# Altium schematic sheet FTDI.SchDoc: TE0888 - FTDI
size A4; Organization: Trenz Electronic GmbH; DocumentNumber: TE0888; Revision: 01; SheetNumber: 4; SheetTotal: 5; Date: 20.05.2015; CompanyName: Trenz Electronic GmbH; ProjectName: TE0888
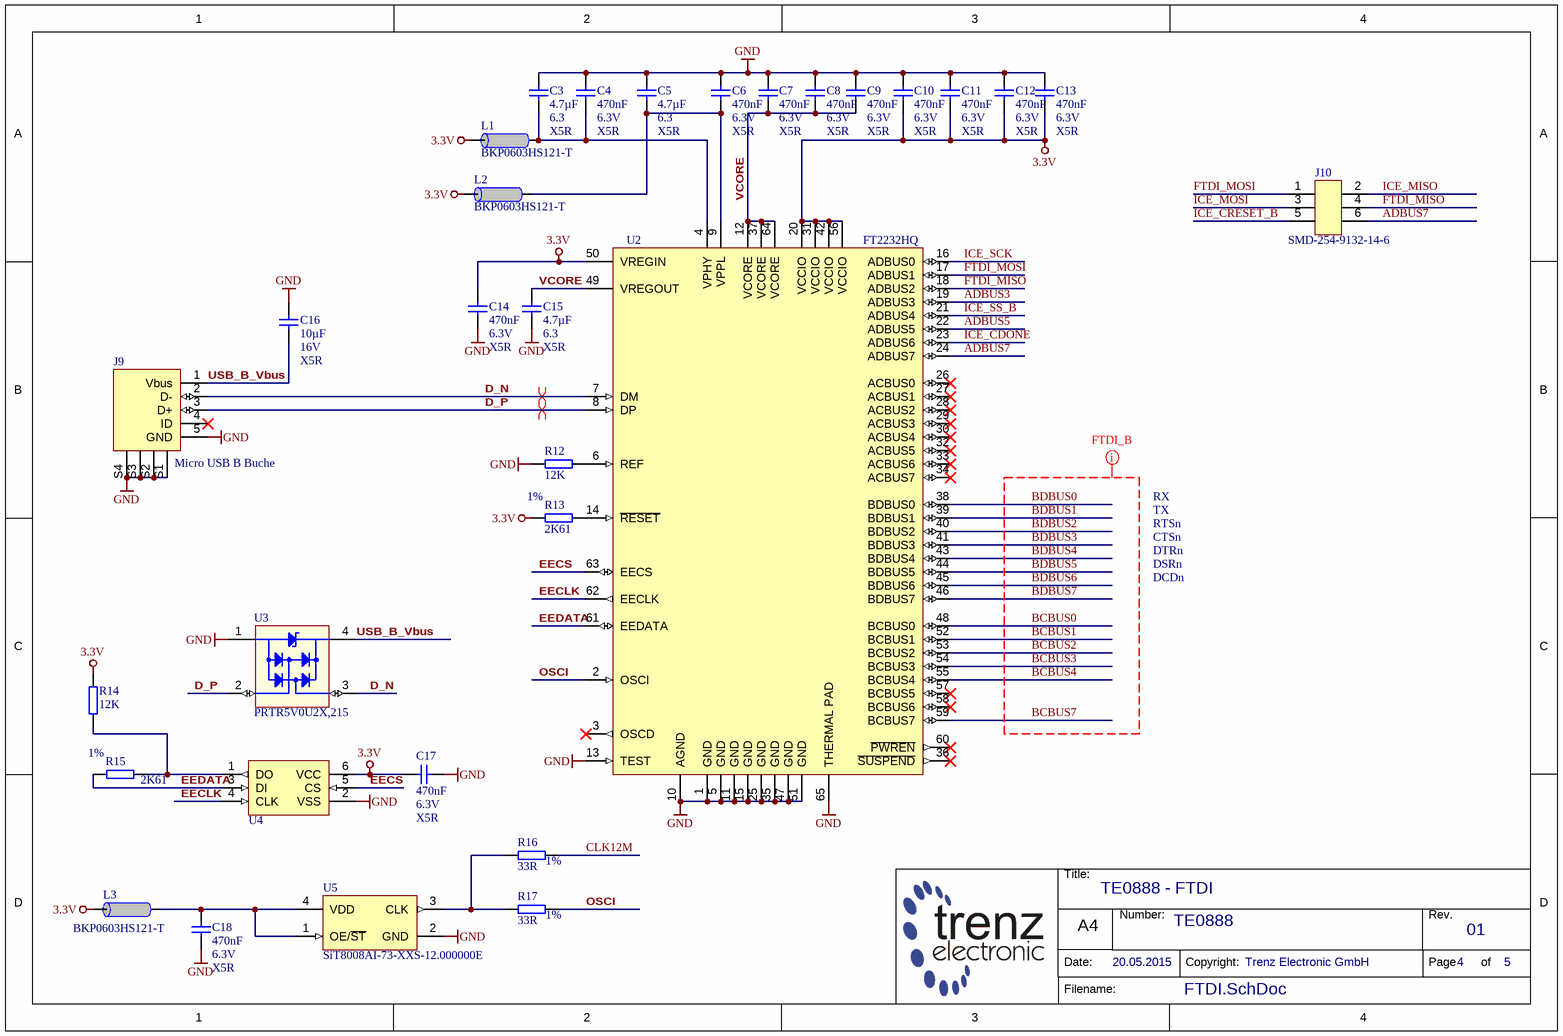
[diagram p0: FTDI.SchDoc]

## Parts
C3  4.7µF  Voltage: 6.3  Technology: X5R  [CAPC1005X60N]
C4  470nF  Voltage: 6.3V  Technology: X5R  [CAPC0603X33N]
C5  4.7µF  Voltage: 6.3  Technology: X5R  [CAPC1005X60N]
C6  470nF  Voltage: 6.3V  Technology: X5R  [CAPC0603X33N]
C7  470nF  Voltage: 6.3V  Technology: X5R  [CAPC0603X33N]
C8  470nF  Voltage: 6.3V  Technology: X5R  [CAPC0603X33N]
C9  470nF  Voltage: 6.3V  Technology: X5R  [CAPC0603X33N]
C10  470nF  Voltage: 6.3V  Technology: X5R  [CAPC0603X33N]
C11  470nF  Voltage: 6.3V  Technology: X5R  [CAPC0603X33N]
C12  470nF  Voltage: 6.3V  Technology: X5R  [CAPC0603X33N]
C13  470nF  Voltage: 6.3V  Technology: X5R  [CAPC0603X33N]
C14  470nF  Voltage: 6.3V  Technology: X5R  [CAPC0603X33N]
C15  4.7µF  Voltage: 6.3  Technology: X5R  [CAPC1005X60N]
C16  10µF  Voltage: 16V  Technology: X5R  [CAPC1608X90N]
C17  470nF  Voltage: 6.3V  Technology: X5R  [CAPC0603X33N]
C18  470nF  Voltage: 6.3V  Technology: X5R  [CAPC0603X33N]
J9  Micro USB B Buche  [Micro USB B SMD W+P]
J10  SMD-254-9132-14-6  [SMD-254-9132-14-6]
L1  BKP0603HS121-T  [INDC0603X33N]
L2  BKP0603HS121-T  [INDC0603X33N]
L3  BKP0603HS121-T  [INDC0603X33N]
R12  12K  [RESC1005X40N]
R13  2K61  Tolerance: 1%  [RESC1005X40N]
R14  12K  [RESC1005X40N]
R15  2K61  Tolerance: 1%  [RESC1005X40N]
R16  33R  Tolerance: 1%  [RESC0603X26N]
R17  33R  Tolerance: 1%  [RESC0603X26N]
U2  FT2232HQ  [QFN50P900X900X100-65N-445]
U3  PRTR5V0U2X,215  [SOT190P229X114-4N]
U4  93AA56BT-I/OT  [SOT95P280X145-6N]  (value not drawn)
U5  SiT8008AI-73-XXS-12.000000E  [2016]

## Nets
3.3V: C10.1 C11.1 C12.1 C13.1 C14.2 C17.1 L1.2 L2.2 L3.2 R13.1 R14.2 U2.20(VCCIO) U2.31(VCCIO) U2.42(VCCIO) U2.50(VREGIN) U2.56(VCCIO) U4.6(VCC)
GND: C3.2 C4.2 C5.2 C6.2 C7.2 C8.2 C9.2 C10.2 C11.2 C12.2 C13.2 C14.1 C15.1 C16.1 C17.2 C18.1 J9.5(GND) J9.S1 J9.S2 J9.S3 J9.S4 R12.1 U2.1(GND) U2.5(GND) U2.10(AGND) U2.11(GND) U2.13(TEST) U2.15(GND) U2.25(GND) U2.35(GND) U2.47(GND) U2.51(GND) U2.65(THERMAL_PAD) U3.1(GND) U4.2(VSS) U5.2(GND)
ADBUS3: U2.19(ADBUS3)
ADBUS5: U2.22(ADBUS5)
ADBUS7: J10.6 U2.24(ADBUS7)
BCBUS0: U2.48(BCBUS0)
BCBUS1: U2.52(BCBUS1)
BCBUS2: U2.53(BCBUS2)
BCBUS3: U2.54(BCBUS3)
BCBUS4: U2.55(BCBUS4)
BCBUS7: U2.59(BCBUS7)
BDBUS0: U2.38(BDBUS0)
BDBUS1: U2.39(BDBUS1)
BDBUS2: U2.40(BDBUS2)
BDBUS3: U2.41(BDBUS3)
BDBUS4: U2.43(BDBUS4)
BDBUS5: U2.44(BDBUS5)
BDBUS6: U2.45(BDBUS6)
BDBUS7: U2.46(BDBUS7)
CLK12M: R16.2
D_N: J9.2(D-) U2.7(DM) U3.3(I/O)
D_P: J9.3(D+) U2.8(DP) U3.2(I/O)
EECLK: U2.62(EECLK) U4.4(CLK)
EECS: U2.63(EECS) U4.5(CS)
EEDATA: R15.1 U2.61(EEDATA) U4.3(DI)
FTDI_MISO: J10.4 U2.18(ADBUS2)
FTDI_MOSI: J10.1 U2.17(ADBUS1)
ICE_CDONE: U2.23(ADBUS6)
ICE_CRESET_B: J10.5
ICE_MISO: J10.2
ICE_MOSI: J10.3
ICE_SCK: U2.16(ADBUS0)
ICE_SS_B: U2.21(ADBUS4)
OSCI: R17.2 U2.2(OSCI)
USB_B_Vbus: C16.2 J9.1(Vbus) U3.4(REF)
VCORE: C7.1 C8.1 C9.1 C15.2 U2.12(VCORE) U2.37(VCORE) U2.49(VREGOUT) U2.64(VCORE)
NetC3_1: C3.1 C4.1 L1.1 U2.4(VPHY)
NetC5_1: C5.1 C6.1 L2.1 U2.9(VPPL)
NetC18_2: C18.2 L3.1 U5.1(OE/~{ST}) U5.4(VDD)
NetR12_2: R12.2 U2.6(REF)
NetR13_2: R13.2 U2.14(~{RESET})
NetR14_1: R14.1 R15.2 U4.1(DO)
NetR16_1: R16.1 R17.1 U5.3(CLK)

Not connected (* = marked no-connect by the designer): J9 4(ID)*; U2 3(OSCD)* 26(ACBUS0)* 27(ACBUS1)* 28(ACBUS2)* 29(ACBUS3)* 30(ACBUS4)* 32(ACBUS5)* 33(ACBUS6)* 34(ACBUS7)* 36(~{SUSPEND})* 57(BCBUS5)* 58(BCBUS6)* 60(~{PWREN})*

## Layout directives
differential pair: D_N, D_P
net class FTDI_B: BCBUS0, BCBUS1, BCBUS2, BCBUS3, BCBUS4, BCBUS7, BDBUS0, BDBUS1, BDBUS2, BDBUS3, BDBUS4, BDBUS5, BDBUS6, BDBUS7

## Notes on the sheet
- RX
- TX
- RTSn
- CTSn
- DTRn
- DSRn
- DCDn
- Title:
- Number:
- Rev.
- Date:
- A4
- Copyright:
- Page
- of
- Filename:

## Library data of the parts
C3 C5 C15 = 24719: KON 4.7µF 6.3V X5R SMD 20%; AN: 24719; Mixed: SMT; Value: 4.7u; Preferred: Yes; Case: 1005 (0402); Tolerance: 20%
C4 C6-C14 C17 C18 = 24921: KON 470nF X5R 6.3V SMD 20%; AN: 24921; Value: 470n; Mixed: SMT; Preferred: Yes; Case: 0603 (0201); Tolerance: 20%
C16 = 25341: KON 10µF 16V X5R SMD 20%; AN: 25341; Mixed: SMT; Value: 10u; Preferred: Yes; Case: 1608 (0603); Tolerance: 20%
J9 = 23760: STE USB MICRO B Buchse SMD; AN: 23760; Mixed: SMT; Trenz-Stock: Yes; HelpURL: B:\AD\adlib\datasheet\8270
J10 = 22742: Stiftleiste gerade 2-reihig, 6pol. SMD; AN: 22742; Mixed: SMT; Trenz-Stock: Yes
L1-L3 = 25393: Ferritdurchführung SMD 0201; AN: 25393; Mixed: SMT; Trenz-Stock: Yes; Tolerance: 25%; Case: 0603 (0201); HelpURL: B:\AD\adlib\datasheet\MULTILAYER CHIP BEAD INDUCTORS BK; Preferred: Yes
R12 R14 = 22598: WID SMD 12K 1% 0,063W; AN: 22598; Mixed: SMT; Preferred: Yes; Case: 1005 (0402); Value: 12K
R13 R15 = 23730: WID SMD 2K61 1% 0,063W; AN: 23730; Mixed: SMT; Value: 2.61K; Preferred: Yes; Case: 1005 (0402)
R16 R17 = 25021: WID SMD 33R 1% 0,05W; AN: 25021; Mixed: SMT; Value: 33; Preferred: Yes; Case: 0603 (0201); HelpURL: B:\AD\adlib\datasheet\R0201
U2 = 24727: AN: 24727; Trenz-Stock: Yes; Mixed: SMT; Case: QFN64; HelpURL: B:\AD\adlib\datasheet\FT2232H; Preferred: Yes
U3 = 24840: AN: 24840; Mixed: SMT; Preferred: Yes; Case: SOT143; HelpURL: B:\AD\adlib\datasheet\CD143A-SR05
U4 = 24730: AN: 24730; Trenz-Stock: Yes; Mixed: SMT; Case: SOT23-6; HelpURL: B:\AD\adlib\datasheet\93AA56A; Preferred: Yes
U5 = 25325: SiT8008AI-73-XXS-12.000000E MEMS Oszillator 12MHz; AN: 25325; Value: 12M; Trenz-Stock: Yes; Mixed: SMT; Case: 2.0  x 1.6mm; HelpURL: B:\AD\adlib\datasheet\SiT8008; Preferred: Yes